# EAGLE design bike_light2 (EAGLE 9.1.1)
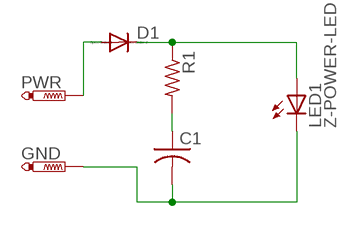
[diagram p0: schematic, sheet 1]

## Parts
C1  SUPERCAP5.5_1FDGH  [CAP_1UF_DGH]
D1  DIODE-DO-214AC  [DO-214AC]
GND  PTR1PAD1-13Y  [P1-13Y]
LED1  Z-POWER-LED  [Z-POWER-LED-PCB-TYPE]
PWR  PTR1PAD1-13Y  [P1-13Y]
R1  R-US_M1206  [M1206]

## Nets
GND: C1.P$2 GND.TP LED1.C
N$1: D1.C LED1.A R1.1
N$4: D1.A PWR.TP
N$5: C1.P$1 R1.2

## Library data of the parts
C1 = christy:SUPERCAP5.5_1F
D1 = diode:DIODE-: DIODE
GND PWR = testpad:PTR1: TEST PIN
LED1 = led:Z-POWER-LED: Z-Power LED Source: http://www.seoulsemicon.co.kr .. X42182.pdf
R1 = rcl:R-US_: RESISTOR, American symbol; SPICEPREFIX: R

## Net classes
0 default: width 0.508 mm, drill 0.508 mm, clearance 0.508 mm

## Board
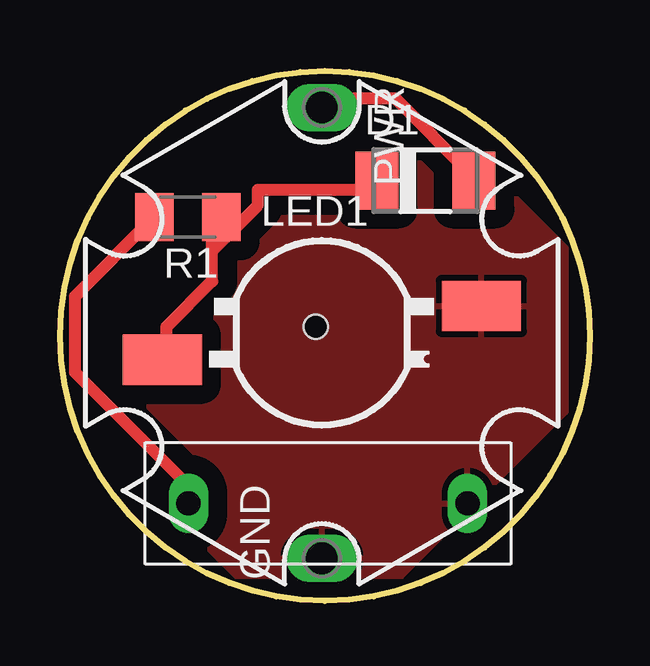
[diagram p1: board, top side]
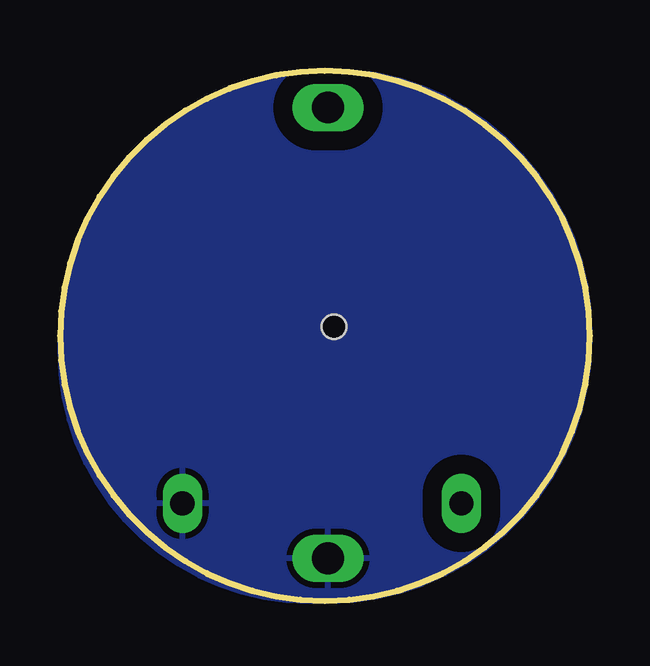
[diagram p2: board, bottom side, seen from below]

Size 22.1 x 22.1 mm. Coordinates in mm from the lower left corner, seen from the top.
Outline: 11.05,0 arc-90 0,11.05 arc-90 11.05,22.1 arc-90 22.1,11.05 arc-90 11.05,0
Copper layers (1*16): Top 0.035mm / dielectric 1.5mm / Bottom 0.035mm
Design rules "OthermillDRC_1_32_v2_18mil": minimum track width 18mil, minimum drill 0.8mm, track to track 0.794003125mm, track to pad 0.794003125mm, pad to pad 0.794003125mm, via to via 0.794003125mm, smd to smd 0mil, copper to edge 0mil, drill to drill 1mil, minimum pad ring 10mil, minimum via ring 10mil, stop-mask expansion 1mil, vias tented up to drill 30mil, thermal gap 10mil
Holes 1.02 mm at 10.67,11.43

### Footprints (pad centres in the part's own frame; a part is rotated, then mirrored left to right if it is on the bottom)
CAP_1UF_DGH = drill 1.016 pad 1.651 long: P$1 -5.817,0; P$2 5.817,0
DO-214AC = smd 1.8 x 2.4: A 2.025,0; C -2.025,0
P1-13Y = drill 1.321 pad 1.905 long: TP 0,0
Z-POWER-LED-PCB-TYPE = smd 3.3 x 2.1: A -6.65,-1.12; C 6.65,1.12
M1206 = smd 1.6 x 2: 1 -1.4,0; 2 1.4,0

### Placement (x,y rotation side)
C1  11.18,4.06 0 top
D1  15.24,17.53 0 top
GND  10.92,1.78 90 top
LED1  10.92,11.18 0 top
PWR  10.92,20.57 270 top
R1  5.33,16 180 top

### Tracks (layer width: path | path; a pad name or v marks a point on that pad's centre or on a via)
GND
  pour Top: 0.51,10.92 0.51,13.97 6.35,19.81 7.37,20.83 14.99,20.83 21.08,14.73 21.08,7.87 14.22,1.02 7.37,1.02 1.52,6.86 0.51,7.87
  pour Bottom: 0,11.18 arc-90 10.92,22.1 11.05,22.1 arc-90 22.1,11.05 22.1,10.41 arc-90 11.68,0 10.92,0 arc-90 0,10.92
N$1
  Top 0.508: 6.35,14.61 6.35,13.34 4.45,11.43 4.45,10.16 LED1.A | 6.35,14.61 6.35,15.88 R1.1 | 6.35,14.61 8.26,16.51 8.26,17.14 12.7,17.14 D1.C
N$4
  Top 0.508: D1.A 17.14,17.78 13.97,20.95 11.43,20.95 PWR.TP
N$5
  Top 0.508: R1.2 3.81,15.88 0.64,12.7 0.64,9.53 5.08,5.08 5.08,4.45 C1.P$1